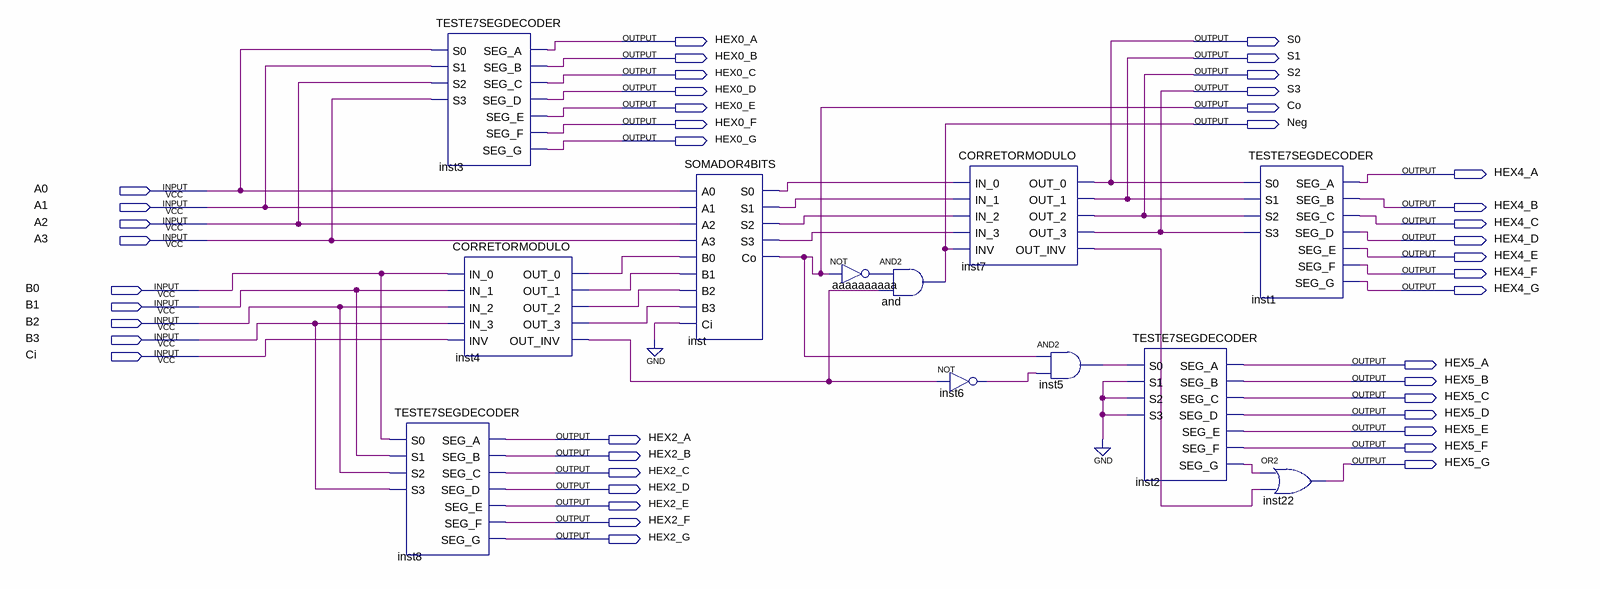
[diagram p0: schematic sheet]
// Quartus schematic SOMADOR4BITS7SEQ.bdf as structural Verilog: 12 symbols, 43 pins
module SOMADOR4BITS7SEQ (
  input  A0,
  input  A1,
  input  A2,
  input  A3,
  input  B0,
  input  B1,
  input  B2,
  input  B3,
  input  Ci,
  output HEX0_A,
  output S0,
  output HEX0_B,
  output S1,
  output HEX0_C,
  output S2,
  output HEX0_D,
  output S3,
  output HEX0_E,
  output Co,
  output HEX0_F,
  output Neg,
  output HEX0_G,
  output HEX4_A,
  output HEX4_B,
  output HEX4_C,
  output HEX4_D,
  output HEX4_E,
  output HEX4_F,
  output HEX4_G,
  output HEX5_A,
  output HEX5_B,
  output HEX5_C,
  output HEX5_D,
  output HEX5_E,
  output HEX2_A,
  output HEX5_F,
  output HEX2_B,
  output HEX5_G,
  output HEX2_C,
  output HEX2_D,
  output HEX2_E,
  output HEX2_F,
  output HEX2_G
);

  wire aaaaaaaaaa_out, inst2_seg_g, inst4_out_0, inst4_out_1, inst4_out_2, inst4_out_3, inst4_out_inv,
       inst5_out, inst6_out, inst7_out_inv, inst_s0, inst_s1, inst_s2, inst_s3;

  TESTE7SEGDECODER inst3 (
    .S0(A0), .S1(A1), .S2(A2), .S3(A3), .SEG_A(HEX0_A), .SEG_B(HEX0_B), .SEG_C(HEX0_C), .SEG_D(HEX0_D),
    .SEG_E(HEX0_E), .SEG_F(HEX0_F), .SEG_G(HEX0_G));
  CORRETORMODULO inst4 (
    .IN_0(B0), .IN_1(B1), .IN_2(B2), .IN_3(B3), .INV(Ci), .OUT_0(inst4_out_0), .OUT_1(inst4_out_1),
    .OUT_2(inst4_out_2), .OUT_3(inst4_out_3), .OUT_INV(inst4_out_inv));
  TESTE7SEGDECODER inst8 (
    .S0(B0), .S1(B1), .S2(B2), .S3(B3), .SEG_A(HEX2_A), .SEG_B(HEX2_B), .SEG_C(HEX2_C), .SEG_D(HEX2_D),
    .SEG_E(HEX2_E), .SEG_F(HEX2_F), .SEG_G(HEX2_G));
  SOMADOR4BITS inst (
    .A0(A0), .A1(A1), .A2(A2), .A3(A3), .B0(inst4_out_0), .B1(inst4_out_1), .B2(inst4_out_2),
    .B3(inst4_out_3), .Ci(1'b0), .S0(inst_s0), .S1(inst_s1), .S2(inst_s2), .S3(inst_s3), .Co(Co));
  not aaaaaaaaaa (aaaaaaaaaa_out, Co);
  and \and  (Neg, aaaaaaaaaa_out, inst4_out_inv);
  CORRETORMODULO inst7 (
    .IN_0(inst_s0), .IN_1(inst_s1), .IN_2(inst_s2), .IN_3(inst_s3), .INV(Neg), .OUT_0(S0), .OUT_1(S1),
    .OUT_2(S2), .OUT_3(S3), .OUT_INV(inst7_out_inv));
  not inst6 (inst6_out, inst4_out_inv);
  and inst5 (inst5_out, Co, inst6_out);
  TESTE7SEGDECODER inst2 (
    .S0(inst5_out), .S1(1'b0), .S2(1'b0), .S3(1'b0), .SEG_A(HEX5_A), .SEG_B(HEX5_B), .SEG_C(HEX5_C),
    .SEG_D(HEX5_D), .SEG_E(HEX5_E), .SEG_F(HEX5_F), .SEG_G(inst2_seg_g));
  TESTE7SEGDECODER inst1 (
    .S0(S0), .S1(S1), .S2(S2), .S3(S3), .SEG_A(HEX4_A), .SEG_B(HEX4_B), .SEG_C(HEX4_C), .SEG_D(HEX4_D),
    .SEG_E(HEX4_E), .SEG_F(HEX4_F), .SEG_G(HEX4_G));
  or inst22 (HEX5_G, inst2_seg_g, inst7_out_inv);
endmodule
